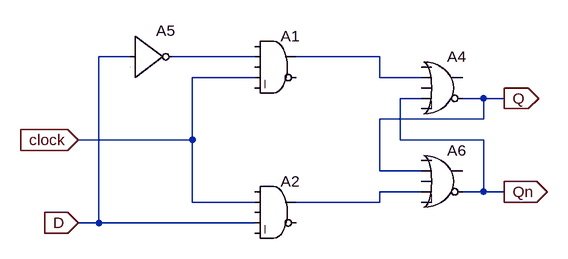
[diagram p0: schematic d_latch.asc]
d_latch.asc, the LTspice schematic file:
Version 4
SHEET 1 880 680
WIRE -128 96 -176 96
WIRE 64 96 -64 96
WIRE 256 96 128 96
WIRE 64 128 -32 128
WIRE 256 128 256 96
WIRE 320 128 256 128
WIRE 320 160 288 160
WIRE 416 160 384 160
WIRE 448 160 416 160
WIRE 416 192 416 160
WIRE 416 192 256 192
WIRE -32 224 -32 128
WIRE -32 224 -208 224
WIRE 288 224 288 160
WIRE 416 224 288 224
WIRE 256 272 256 192
WIRE 320 272 256 272
WIRE 320 304 256 304
WIRE 416 304 416 224
WIRE 416 304 384 304
WIRE 448 304 416 304
WIRE -32 320 -32 224
WIRE 64 320 -32 320
WIRE 256 320 256 304
WIRE 256 320 128 320
WIRE -176 352 -176 96
WIRE -176 352 -208 352
WIRE 64 352 -176 352
FLAG -208 224 clock
IOPIN -208 224 In
FLAG -208 352 D
IOPIN -208 352 In
FLAG 448 160 Q
IOPIN 448 160 Out
FLAG 448 304 Qn
IOPIN 448 304 Out
SYMBOL Digital\\and 96 48 R0
SYMATTR InstName A1
SYMBOL Digital\\and 96 272 R0
SYMATTR InstName A2
SYMBOL Digital\\inv -128 32 R0
SYMATTR InstName A5
SYMBOL Digital\\or 352 80 R0
SYMATTR InstName A4
SYMBOL Digital\\or 352 224 R0
SYMATTR InstName A6

The netlist it stands for:
* d_latch.asc
A1 0 N001 0 clock 0 0 N002 0 AND
A2 0 clock 0 D 0 0 N003 0 AND
A5 D 0 0 0 0 N001 0 0 BUF
A4 0 N002 0 Qn 0 Q 0 0 OR
A6 0 Q 0 N003 0 Qn 0 0 OR
.backanno
.end